# Altium schematic sheet CAN Interface.SchDoc
size A4; SheetNumber: 4; SheetTotal: 7
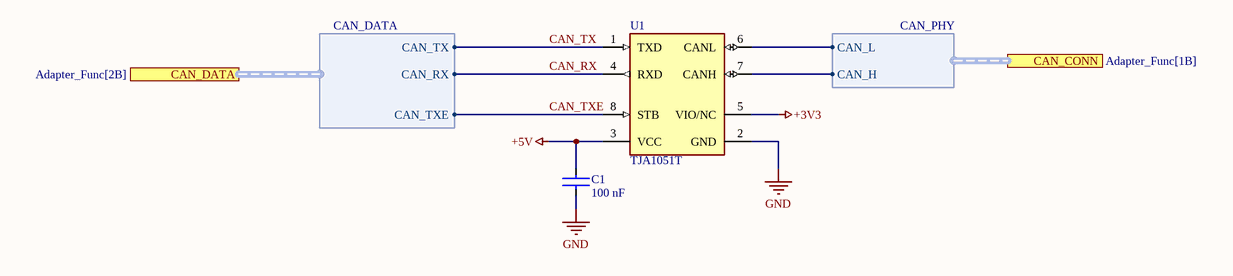
[diagram p0: CAN Interface.SchDoc]

## Parts
C1  100 nF  [0603 SMD CAP]
U1  TJA1051T  [SOIC-8]

## Ports
CAN_CONN (harness CAN_PHY, see Adapter_Func[1B]), CAN_DATA (harness CAN_DATA, see Adapter_Func[2B])

## Harnesses
CAN_DATA: CAN_TX, CAN_RX, CAN_TXE
CAN_PHY: CAN_L, CAN_H

## Nets
+3V3: U1.5(VIO/NC)
+5V: C1.2 U1.3(VCC)
GND: C1.1 U1.2(GND)
CAN_RX: U1.4(RXD) ; port CAN_DATA.CAN_RX
CAN_TX: U1.1(TXD) ; port CAN_DATA.CAN_TX
CAN_TXE: U1.8(STB) ; port CAN_DATA.CAN_TXE
NetU1_6: U1.6(CANL) ; port CAN_CONN.CAN_L
NetU1_7: U1.7(CANH) ; port CAN_CONN.CAN_H

## Library data of the parts
C1 = Cap 100nF 0603: 25V 100nF X7R ±10% 0603 Multilayer Ceramic Capacitors MLCC; Part Number: CL10B104KA8NNNC; ComponentLink1Description: LCSC; ComponentLink1URL: https://lcsc.com/product-detail/Multilayer-Ceramic-Capacitors-MLCC-SMD-SMT_Samsung-Electro-Mechanics-CL10B104KA8NNNC_C1590.html
U1 = CAN Transeiver TJA1051T: TJA1051T CAN Transeiver up to 5 Mbaud/s; Part Number: TJA1051T,118; ComponentLink1Description: Datasheet; ComponentLink1URL: https://datasheet.lcsc.com/lcsc/1809192316_NXP-Semicon-TJA1051T-118_C18387.pdf